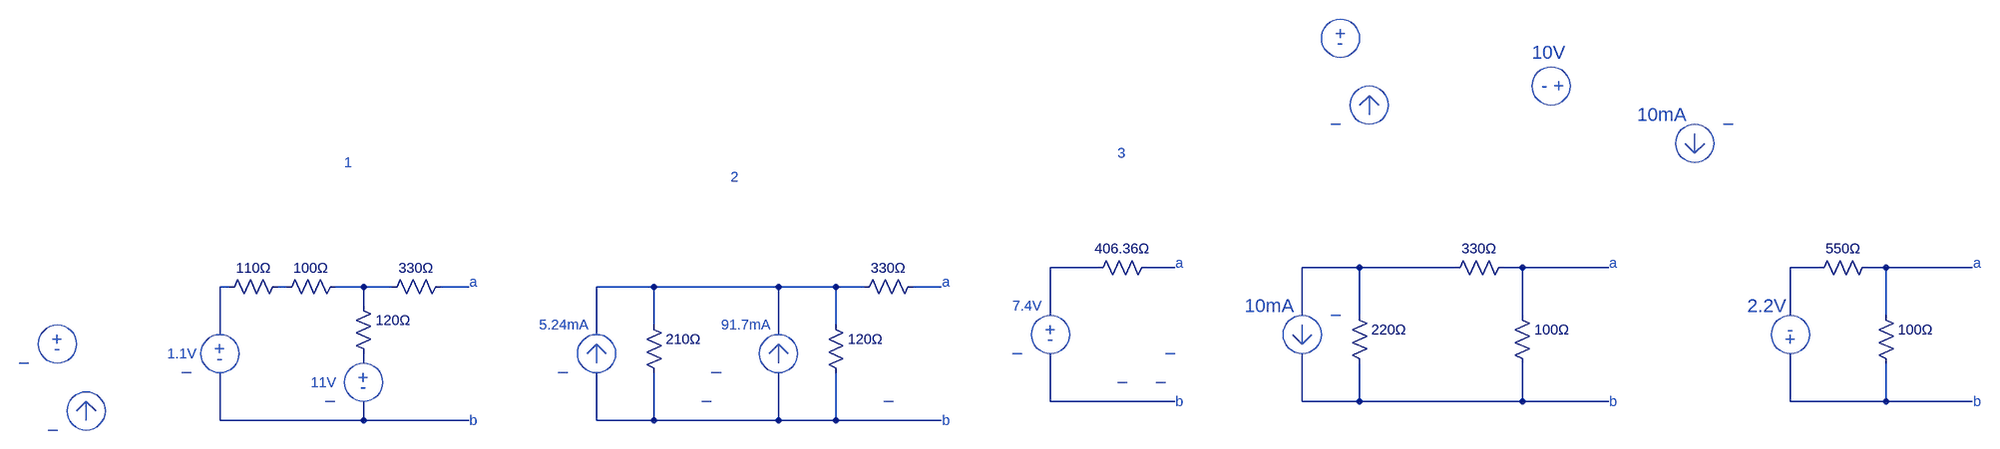
[diagram p0: schematic ELE112-4.asc]
ELE112-4.asc, the LTspice schematic file:
Version 4.1
SHEET 1 4324 680
WIRE 2272 -32 2192 -32
WIRE 2400 -32 2352 -32
WIRE 3072 -32 2976 -32
WIRE 3232 -32 3072 -32
WIRE 3344 -32 3312 -32
WIRE 3488 -32 3344 -32
WIRE 3840 -32 3792 -32
WIRE 3952 -32 3920 -32
WIRE 4096 -32 3952 -32
WIRE 320 0 304 0
WIRE 416 0 400 0
WIRE 544 0 496 0
WIRE 592 0 544 0
WIRE 720 0 672 0
WIRE 1296 0 1200 0
WIRE 1504 0 1296 0
WIRE 1600 0 1504 0
WIRE 1648 0 1600 0
WIRE 1776 0 1728 0
WIRE 544 32 544 0
WIRE 2192 48 2192 -32
WIRE 2976 48 2976 -32
WIRE 3072 48 3072 -32
WIRE 3344 48 3344 -32
WIRE 3792 48 3792 -32
WIRE 3952 48 3952 -32
WIRE 1296 64 1296 0
WIRE 1600 64 1600 0
WIRE 304 80 304 0
WIRE 1200 80 1200 0
WIRE 1504 80 1504 0
WIRE 544 128 544 112
WIRE 2192 192 2192 112
WIRE 2400 192 2192 192
WIRE 2976 192 2976 112
WIRE 3072 192 3072 128
WIRE 3072 192 2976 192
WIRE 3344 192 3344 128
WIRE 3344 192 3072 192
WIRE 3488 192 3344 192
WIRE 3792 192 3792 112
WIRE 3952 192 3952 128
WIRE 3952 192 3792 192
WIRE 4096 192 3952 192
WIRE 304 224 304 144
WIRE 544 224 544 192
WIRE 544 224 304 224
WIRE 720 224 544 224
WIRE 1200 224 1200 144
WIRE 1296 224 1296 144
WIRE 1296 224 1200 224
WIRE 1504 224 1504 144
WIRE 1504 224 1296 224
WIRE 1600 224 1600 144
WIRE 1600 224 1504 224
WIRE 1776 224 1600 224
SYMBOL res 416 -16 R90
WINDOW 0 0 56 VBottom 2
WINDOW 3 32 56 VTop 2
SYMATTR InstName 110Ω
SYMATTR Value ""
SYMBOL res 512 -16 R90
WINDOW 0 0 56 VBottom 2
WINDOW 3 32 56 VTop 2
SYMATTR InstName 100Ω
SYMATTR Value ""
SYMBOL res 528 16 R0
SYMATTR InstName 120Ω
SYMATTR Value ""
SYMBOL res 688 -16 R90
WINDOW 0 0 56 VBottom 2
WINDOW 3 32 56 VTop 2
SYMATTR InstName 330Ω
SYMATTR Value ""
SYMBOL res 1280 48 R0
SYMATTR InstName 210Ω
SYMATTR Value ""
SYMBOL res 1744 -16 R90
WINDOW 0 0 56 VBottom 2
WINDOW 3 32 56 VTop 2
SYMATTR InstName 330Ω
SYMATTR Value ""
SYMBOL res 1584 48 R0
SYMATTR InstName 120Ω
SYMATTR Value ""
SYMBOL res 2368 -48 R90
WINDOW 0 0 56 VBottom 2
WINDOW 3 32 56 VTop 2
SYMATTR InstName 406.36Ω
SYMATTR Value ""
SYMBOL res 3056 32 R0
SYMATTR InstName 220Ω
SYMATTR Value ""
SYMBOL res 3328 -48 R90
WINDOW 0 0 56 VBottom 2
WINDOW 3 32 56 VTop 2
SYMATTR InstName 330Ω
SYMATTR Value ""
SYMBOL res 3328 32 R0
SYMATTR InstName 100Ω
SYMATTR Value ""
SYMBOL res 3936 -48 R90
WINDOW 0 0 56 VBottom 2
WINDOW 3 32 56 VTop 2
SYMATTR InstName 550Ω
SYMATTR Value ""
SYMBOL res 3936 32 R0
SYMATTR InstName 100Ω
SYMATTR Value ""
TEXT -16 88 Center 3 ;+
TEXT -16 104 Center 3 ;-
TEXT 304 104 Center 3 ;+
TEXT 304 120 Center 3 ;-
TEXT 216 112 Left 2 ;1.1V
TEXT 544 152 Center 3 ;+
TEXT 544 168 Center 3 ;-
TEXT 456 160 Left 2 ;11V
TEXT 728 -8 Center 2 ;a
TEXT 728 224 Center 2 ;b
TEXT 1784 -8 Center 2 ;a
TEXT 1784 224 Center 2 ;b
TEXT 512 -208 Left 2 ;1
TEXT 1424 -184 Left 2 ;2
TEXT 1104 64 Left 2 ;5.24mA
TEXT 1408 64 Left 2 ;91.7mA
TEXT 2408 -40 Center 2 ;a
TEXT 2408 192 Center 2 ;b
TEXT 2304 -224 Left 2 ;3
TEXT 2128 32 Left 2 ;7.4V
TEXT 2192 72 Center 3 ;+
TEXT 2192 88 Center 3 ;-
TEXT 3496 -40 Center 2 ;a
TEXT 3496 192 Center 2 ;b
TEXT 3040 -424 Center 3 ;+
TEXT 3040 -408 Center 3 ;-
TEXT 3376 -336 Left 3 ;- +
TEXT 3360 -392 Left 3 ;10V
TEXT 2880 32 Left 3 ;10mA
TEXT 4104 -40 Center 2 ;a
TEXT 4104 192 Center 2 ;b
TEXT 3536 -288 Left 3 ;10mA
TEXT 3792 88 Center 3 ;+
TEXT 3792 72 Center 3 ;-
TEXT 3720 32 Left 3 ;2.2V
LINE Normal 32 192 32 224
LINE Normal 48 208 32 192
LINE Normal 32 192 48 208
LINE Normal 16 208 32 192
LINE Normal 1200 96 1200 128
LINE Normal 1216 112 1200 96
LINE Normal 1200 96 1216 112
LINE Normal 1184 112 1200 96
LINE Normal 1504 96 1504 128
LINE Normal 1520 112 1504 96
LINE Normal 1504 96 1520 112
LINE Normal 1488 112 1504 96
LINE Normal 3088 -320 3088 -288
LINE Normal 3104 -304 3088 -320
LINE Normal 3088 -320 3104 -304
LINE Normal 3072 -304 3088 -320
LINE Normal 2976 96 2976 64
LINE Normal 2960 80 2976 96
LINE Normal 2976 96 2960 80
LINE Normal 2992 80 2976 96
LINE Normal 3632 -224 3632 -256
LINE Normal 3616 -240 3632 -224
LINE Normal 3632 -224 3616 -240
LINE Normal 3648 -240 3632 -224
CIRCLE Normal -16 240 -32 240 2
CIRCLE Normal 64 240 0 176
CIRCLE Normal -64 128 -80 128 2
CIRCLE Normal 16 128 -48 64
CIRCLE Normal 256 144 240 144 2
CIRCLE Normal 336 144 272 80
CIRCLE Normal 496 192 480 192 2
CIRCLE Normal 576 192 512 128
CIRCLE Normal 1152 144 1136 144 2
CIRCLE Normal 1392 192 1376 192 2
CIRCLE Normal 1152 144 1136 144 2
CIRCLE Normal 1232 144 1168 80
CIRCLE Normal 1408 144 1392 144 2
CIRCLE Normal 1696 192 1680 192 2
CIRCLE Normal 1408 144 1392 144 2
CIRCLE Normal 1536 144 1472 80
CIRCLE Normal 2144 112 2128 112 2
CIRCLE Normal 2384 160 2368 160 2
CIRCLE Normal 2144 112 2128 112 2
CIRCLE Normal 2400 112 2384 112 2
CIRCLE Normal 2320 160 2304 160 2
CIRCLE Normal 2400 112 2384 112 2
CIRCLE Normal 2144 112 2128 112 2
CIRCLE Normal 2224 112 2160 48
CIRCLE Normal 3040 -272 3024 -272 2
CIRCLE Normal 3120 -272 3056 -336
CIRCLE Normal 3072 -384 3008 -448
CIRCLE Normal 3024 48 3040 48 2
CIRCLE Normal 2944 48 3008 112
CIRCLE Normal 3360 -304 3424 -368
CIRCLE Normal 3680 -272 3696 -272 2
CIRCLE Normal 3600 -272 3664 -208
CIRCLE Normal 3760 48 3824 112

The netlist it stands for:
* ELE112-4.asc
R§110Ω N008 N007
R§100Ω N009 N008
R§120Ω N009 N013
R§330Ω N010 N009
R§210Ω N011 N018
R§330Ω N012 N011
R§120Ω N011 N018
R§406.36Ω N002 N001
R§220Ω N003 N015
R§330Ω N004 N003
R§100Ω N004 N015
R§550Ω N006 N005
R§100Ω N006 N016
* +
* -
* +
* -
* 1.1V
* +
* -
* 11V
* a
* b
* a
* b
* 1
* 2
* 5.24mA
* 91.7mA
* a
* b
* 3
* 7.4V
* +
* -
* a
* b
* +
* -
* - +
* 10V
* 10mA
* a
* b
* 10mA
* +
* -
* 2.2V
.backanno
.end